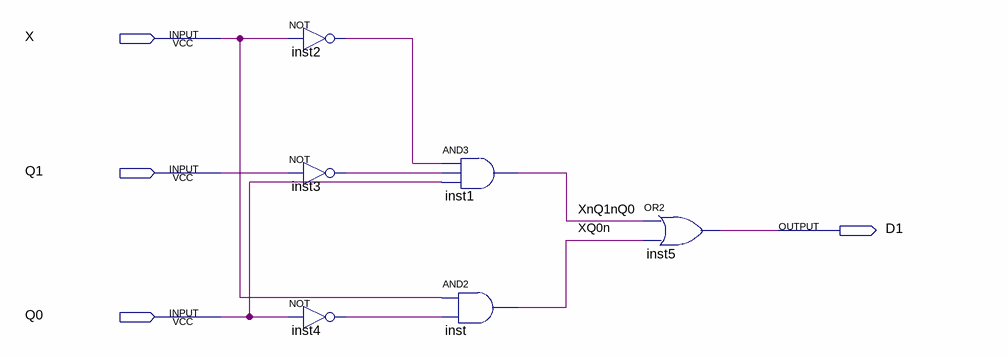
[diagram p0: schematic sheet]
// Quartus schematic D1.bdf as structural Verilog: 6 symbols, 4 pins
module D1 (
  input  X,
  input  Q1,
  input  Q0,
  output D1
);

  wire inst2_out, inst3_out, inst4_out, XnQ1nQ0, XQ0n;

  not inst2 (inst2_out, X);
  not inst3 (inst3_out, Q1);
  not inst4 (inst4_out, Q0);
  and inst1 (XnQ1nQ0, inst2_out, inst3_out, Q0);
  and inst (XQ0n, X, inst4_out);
  or inst5 (D1, XnQ1nQ0, XQ0n);
endmodule
